# Altium schematic sheet PowerModuleCell.SchDoc
size A4; SheetNumber: 1; SheetTotal: 11
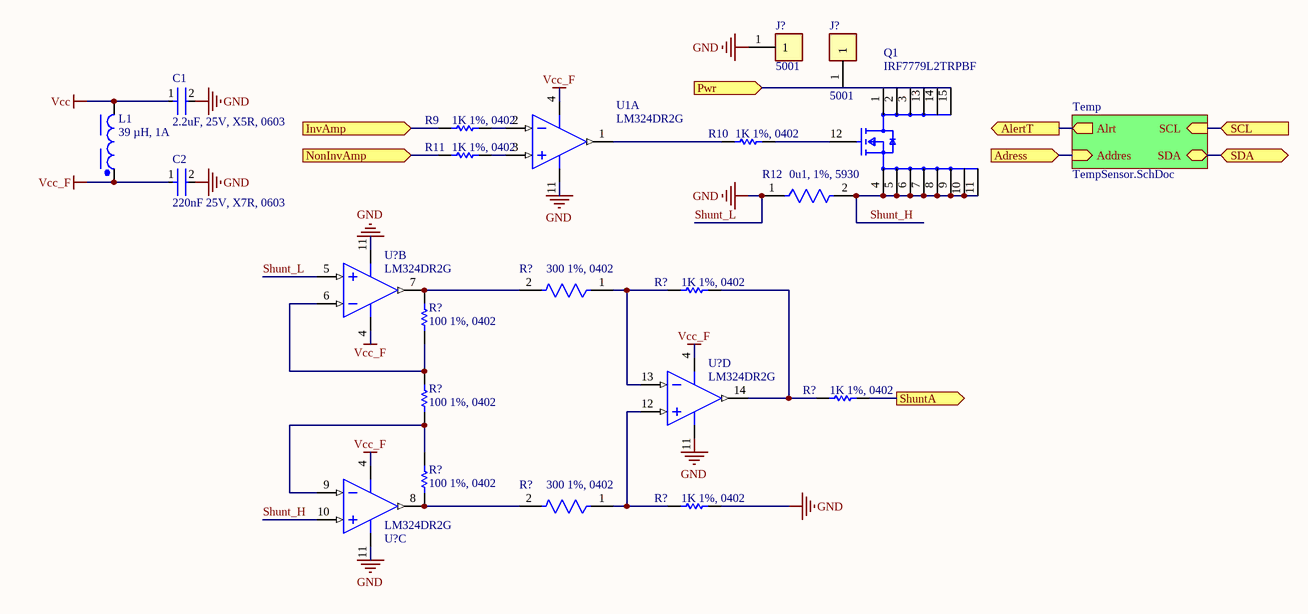
[diagram p0: PowerModuleCell.SchDoc]

## Parts
(Parts that share a designator on the sheet are numbered #1, #2 ... from top to bottom, then left to right.)
C1  2.2uF, 25V, X5R, 0603  [FP-GRM188-0_1-e0_2_0_5-MFG]
C2  220nF 25V, X7R, 0603  [FP-GCM188-0_1-IPC_B]
J?#1  5001  [FP-5001-MFG]  (no BOM)
J?#2  5001  [FP-5001-MFG]  (no BOM)
L1  39 µH, 1A  [WE-PD_7345]
Q1  IRF7779L2TRPBF  [FP-MG-WDSON-11-MFG]
R9  1K 1%, 0402  [RESC1005X40X25NL05T05]
R10  1K 1%, 0402  [RESC1005X40X25NL05T05]
R11  1K 1%, 0402  [RESC1005X40X25NL05T05]
R12  0u1, 1%, 5930  [FP-CSS2H-5930K-1L00F-MFG]
R?#1  300 1%, 0402  [FP-ERJ2RK-IPC_A]
R?#2  1K 1%, 0402  [RESC1005X40X25NL05T05]
R?#3  100 1%, 0402  [RESC1005X40X25LL05T05]
R?#4  1K 1%, 0402  [RESC1005X40X25NL05T05]
R?#5  100 1%, 0402  [RESC1005X40X25LL05T05]
R?#6  100 1%, 0402  [RESC1005X40X25LL05T05]
R?#7  300 1%, 0402  [FP-ERJ2RK-IPC_A]
R?#8  1K 1%, 0402  [RESC1005X40X25NL05T05]
U1  LM324DR2G  [ONSC-SOIC-14-751A-03_V]  (part A of 4)
U?#1  LM324DR2G  [ONSC-SOIC-14-751A-03_V]  (part B of 4)
U?#2  LM324DR2G  [ONSC-SOIC-14-751A-03_V]  (part D of 4)
U?#3  LM324DR2G  [ONSC-SOIC-14-751A-03_V]  (part C of 4)

## Sub-sheets
Temp = TempSensor.SchDoc: Alrt (out), SDA (bidir), SCL (in), Addres (in)

## Ports
Adress (in), AlertT (out), InvAmp (in, see PowerModule[5A]), NonInvAmp (in, see PowerModule[5A]), Pwr (in, see PowerModule[5A]), SCL (in, see PowerModule[6A], TempSensor[3C]), SDA (bidir, see PowerModule[6A], TempSensor[3C]), ShuntA (out, see PowerModule[5A])

## Nets
Shunt_L: C1.2 C2.2 J?#1.1 R12.1 R?#8.2 U1.11(VEE/GND) U?#1.5(IN2+) U?#1.11(VEE/GND) U?#3.11(VEE/GND)  [also labelled GND]
Vcc: C1.1 L1.2
Vcc_F: C2.1 L1.1 U1.4(VCC) U?#1.4(VCC) U?#2.4(VCC) U?#3.4(VCC)
Adress: port Adress, sheet Temp/Addres
AlertT: port AlertT, sheet Temp/Alrt
InvAmp: R9.1 ; port InvAmp
NonInvAmp: R11.1 ; port NonInvAmp
Pwr: J?#2.1 Q1.1(Drain) Q1.2(Drain) Q1.3(Drain) Q1.13(Drain) Q1.14(Drain) Q1.15(Drain) ; port Pwr
SCL: port SCL, sheet Temp/SCL
SDA: port SDA, sheet Temp/SDA
Shunt_H: Q1.4(Source) Q1.5(Source) Q1.6(Source) Q1.7(Source) Q1.8(Source) Q1.9(Source) Q1.10(Source) Q1.11(Source) R12.2 U?#3.10(IN3+)
ShuntA: R?#4.2 ; port ShuntA
NetQ1_12: Q1.12(Gate) R10.2
NetR9_2: R9.2 U1.2(IN1-)
NetR10_1: R10.1 U1.1(OUT1)
NetR11_2: R11.2 U1.3(IN1+)
NetR?#1_1: R?#1.1 R?#2.1 U?#2.13(IN4-)
NetR?#1_2: R?#1.2 R?#3.2 U?#1.7(OUT2)
NetR?#2_2: R?#2.2 R?#4.1 U?#2.14(OUT4)
NetR?#3_1: R?#3.1 R?#5.2 U?#1.6(IN2-)
NetR?#5_1: R?#5.1 R?#6.2 U?#3.9(IN3-)
NetR?#6_1: R?#6.1 R?#7.2 U?#3.8(OUT3)
NetR?#7_1: R?#7.1 R?#8.1 U?#2.12(IN4+)

Not connected (* = marked no-connect by the designer): U?#2 11(VEE/GND)

## Notes on the sheet
- Labels drawn without touching a wire or pin: GND

## Library data of the parts
C1 = CMP-2006-02820-2: Chip Multilayer Ceramic Capacitors for General Purpose, 0603, 2.2uF, X5R, 15%, 10%, 25V; Number of Pins: 2; Dielectric: X5R; Tolerance: 10%; Case Code (Imperial): 0603; Thickness: 0.035inch; Case/Package: 0603; Lead Free: Lead Free; Mount: Surface Mount; Material: Ceramic; Depth: 0.8mm; Voltage: 25V; Capacitance: 2.2uF; Min Operating Temperature: -55°C; Package Quantity: 4000; REACH SVHC: No SVHC; Resistor Type: Ceramic; Packaging: Tape and Reel; Case Code (Metric): 1608; Max Operating Temperature: 85°C; Width: 0.8mm; Termination: SMD/SMT; Voltage Rating: 25V; Length: 1.6mm; Voltage Rating (DC): 25V; Height: 0.8mm; Radiation Hardening: No; Weight: 0.000222oz
C2 = CMP-2006-02366-2: Ceramic Capacitor for Automotive 220nF  ±10% 25VDC X7R 0603 Paper T/R; Capacitance: 220nF; Mount: Surface Mount; Ratings: AEC-Q200; Case/Package: 0603; Packaging: Tape and Reel; Radiation Hardening: No; Voltage: 25V; Dielectric: X7R; Case Code (Imperial): 0603; Max Operating Temperature: 125°C; Min Operating Temperature: -55°C; Depth: 0.8mm; Termination: SMD/SMT; Package Quantity: 1; Case Code (Metric): 1608; Thickness: 0.035inch; Voltage Rating: 25V; Tolerance: 10%; Voltage Rating (DC): 25V; Height: 0.8mm; Lead Free: Lead Free; Length: 1.6mm; Width: 0.031inch
J?#1 J?#2 = CMP-2000-05181-2: PC TEST POINT MINIATURE BLACK; Body Material: Bronze; Plating: Silver; Inside Diameter: 1.27mm; Hole Diameter: 1.6mm; Number of Ports: 1; Outside Diameter: 2.54mm; Insulation: Insulated; Insulation Material: Nylon; Mount: Through Hole; RoHS Compliant: Yes; Series: THM; Height: 0.3inch; Termination: Through Hole; Material: Nylon; Packaging: Bulk; Contact Material: Bronze; REACH SVHC: No SVHC; Contact Plating: Silver; Orientation: Straight; Lead Free: Lead Free; Package Quantity: 100; Length: 7.62mm; Flammability Rating: UL94 V-0; Number of Contacts: 1; Diameter: 2.54mm; Housing Color: Black; Color: Black
L1 = CMP-0227-00153-2: NexarPartId: 29930417; Max DC Current: 1.11A; Shielding: Shielded; Inductance: 39µH; Self Resonant Frequency: 11MHz; DC Resistance (DCR): 145mΩ; Tolerance: 20%; Ambient Temperature Range Low: -40°C; Width: 7.3mm; Length: 7.3mm; Number of Pins: 2; Packaging: Tape & Reel; Height: 4.5mm; Ambient Temperature Range High: 85°C; Max Operating Temperature: 125°C; Depth: 7.3mm; Min Operating Temperature: -40°C; RoHS: Compliant; Current Rating: 1.11A
Q1 = CMP-32901-000937-1: MOSFET N-CH 150V 375A DIRECTFET; Drain to Source Resistance: 11mR; Power Dissipation: 125W; Turn-On Delay Time: 16ns; Threshold Voltage: 4V; Input Capacitance: 6.66nF; Turn-Off Delay Time: 36ns; Gate to Source Voltage (Vgs): 20V; Length: 0.36inch; Number of Pins: 11; Min Operating Temperature: -55°C; Halogen Free: Halogen Free; Rds On Max: 11mR; REACH SVHC: No SVHC; Max Operating Temperature: 175°C; Continuous Drain Current (ID): 375A; Max Power Dissipation: 125W; Mount: Surface Mount; Width: 0.28inch; Max Dual Supply Voltage: 150V; Lead Free: Lead Free; Height: 0.02inch; Series: HEXFET®; RoHS Compliant: Yes; Drain to Source Voltage (Vdss): 150V; Packaging: Cut Tape
R9-R11 R?#2 R?#4 R?#8 = CMP-1011-00510-4: Chip Resistor, 1 KOhm, +/- 1%, 100 mW, -55 to 155 degC, 0402 (1005 Metric), RoHS, Tape and Reel; PartNumber: ERJ-2RKF1001X; Manufacturer: Basic Passives; Voltage Rating: 50 V; Case\/Package: 0402; Resistance: 1 KOhm; Power Rating: 100 mW; DatasheetVersion: 04/2015; Radiation Hardening: No; Pins: 2; Height: 0.35 mm; RoHSCompliant: true; Case Code (Imperial): 0402; ComponentLink2Description: Datasheet; ComponentLink1Description: Manufacturer URL; PackageReference: 0402; Mount: Surface Mount; Package Quantity: 10000; Tolerance: 1%; ComponentLink1URL: http://www.panasonic.com/; PackageDescription: 2-Pin Surface Mount Device, Body 1 x 0.5 mm; Mounting Technology: Surface Mount; Case Code (Metric): 1005; ComponentLink2URL: http://industrial.panasonic.com/cdbs/www-data/pdf/RDA0000/AOA0000C86.pdf; REACH SVHC: Yes; Packaging: Tape and Reel; Max Operating Temperature: 155 degC; Min Operating Temperature: -55 degC; Width: 0.5 mm; Length: 1 mm
R12 = CMP-00059-73869598-1: CSS2H-5930K-1L00F Res Metal Strip 5930 0.001 Ohm 1% 9W ±50ppm/C Pad SMD Automotive T/R; Resistance: 1mΩ; Temperature Coefficient: 50ppm/°C; Case Code (Imperial): 5931; Width: 7.747mm; Min Operating Temperature: -55°C; Tolerance: 1%; Max Power Dissipation: 9W; Case Code (Metric): 1577; Max Operating Temperature: 170°C; NexarPartId: 73869598; Power Rating: 9W; Composition: Metal Element; Case/Package: 5930; Height: 939.8µm; Number of Terminations: 2; Schedule B: 8533210045, 8533210045; Packaging: Cut Tape; REACH SVHC: No SVHC; Features: Moisture Resistant; RoHS: Compliant; Length: 15.0114mm
R?#1 R?#7 = CMP-1011-00449-3: RES SMD 300 OHM 1% 1/10W 0402; Power Rating: 100mW; Voltage Rating: 50V; Temperature Coefficient: 100ppm/°C; Resistance: 300R; Case Code (Imperial): 0402; Termination: SMD/SMT; REACH SVHC: No SVHC; Number of Terminations: 2; Composition: Thick Film; Case Code (Metric): 1005; Voltage Rating (DC): 50V; Packaging: Tape and Reel; Max Power Dissipation: 100mW; Tolerance: 1%; Lead Free: Lead Free; Military Standard: Not; Mount: Surface Mount; Height: 0.35mm; Package Quantity: 10000; Max Operating Temperature: 155°C; Depth: 0.5mm; Min Operating Temperature: -55°C; Length: 1mm; Contact Plating: Tin; Width: 0.02inch; Case/Package: 0402
R?#3 R?#5 R?#6 = CMP-2002-00605-3: Chip Resistor, 100 Ohm, +/- 1%, 100 mW, -55 to 155 degC, 0402 (1005 Metric), RoHS, Tape and Reel; Manufacturer: Basic Passives; PartNumber: ERJ-2RKF1000X; Power Rating: 100 mW; Resistance: 100 Ohm; Voltage Rating: 50 V; Case\/Package: 0402; Width: 0.5 mm; Pins: 2; ComponentLink2Description: Datasheet; PackageReference: 0402; Height: 0.35 mm; Tolerance: 1%; DatasheetVersion: 04/2015; Case Code (Imperial): 0402; Min Operating Temperature: -55 degC; Radiation Hardening: No; Length: 1 mm; Package Quantity: 10000; PackageDescription: 2-Pin Surface Mount Device, Body 1 x 0.5 mm; Mounting Technology: Surface Mount; Case Code (Metric): 1005; Packaging: Tape and Reel; ComponentLink1URL: http://www.panasonic.com/; RoHSCompliant: true; Max Operating Temperature: 155 degC; REACH SVHC: Yes; ComponentLink1Description: Manufacturer URL; ComponentLink2URL: http://industrial.panasonic.com/cdbs/www-data/pdf/RDA0000/AOA0000C86.pdf; Mount: Surface Mount
U1 U?#1-U?#3 = CMP-1310-00171-1: Single Supply Quad Operational Amplifier, 3 to 32 V, 0 to 70 degC, 14-Pin SOIC, Pb-Free, Tape and Reel; Manufacturer: On Semiconductor; VCC Max (V): 32; VCC Min (V): 3; PackageVersion: Rev. K, 05/2011; ComponentLink3URL: http://www.onsemi.com/pub_link/Collateral/751A-03.PDF; ComponentLink3Description: Package Specification; Packing: Tape and Reel; ComponentLink2URL: http://www.onsemi.cn/pub_link/Collateral/LM324-D.PDF; PackageReference: SOIC-14-751A-03; ComponentLink1URL: http://www.onsemi.com/; PackageDescription: 14-Pin Small Outline Integrated Circuit, Body 8.65 x 3.9 mm, Pitch 1.27 mm; ComponentLink1Description: Manufacturer URL; DatasheetVersion: Rev. 25; Mounting Technology: Surface Mount; RoHS: TRUE; ComponentLink2Description: Datasheet; PartNumber: LM324DR2G